# Altium project PCB_Project.PrjPcb
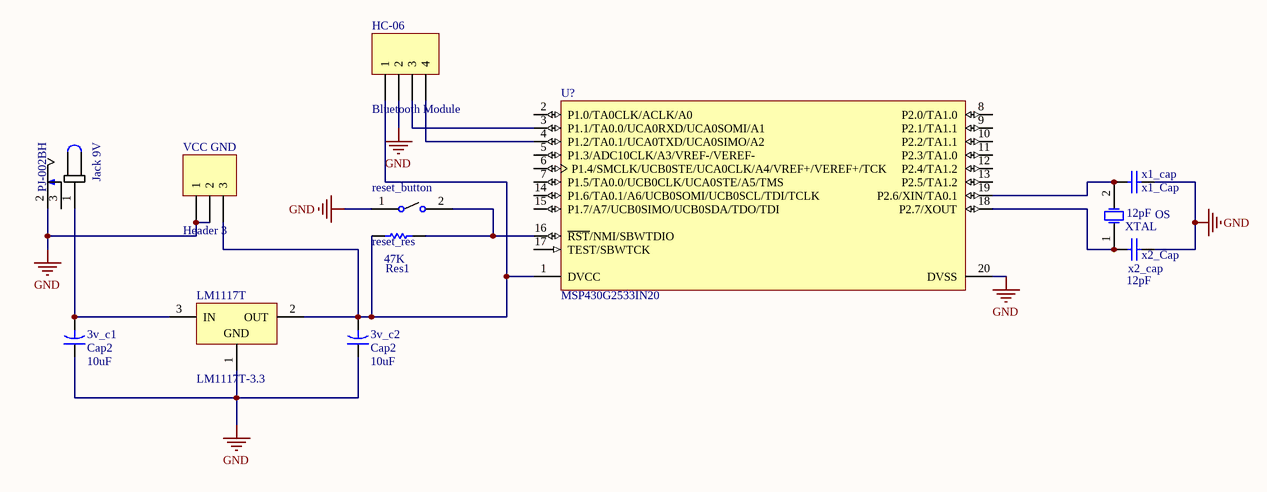
[diagram p0: Sheet1.SchDoc]
1 sheet, 12 parts. Net scope: global (net labels, ports and power ports of the same name join across sheets).
Board file: PCB1.PcbDoc

## Sheet Sheet1.SchDoc
size A4

### Parts
3v_c1  Cap2  value 10uF  [CAPR5-4X5]
3v_c2  Cap2  value 10uF  [CAPR5-4X5]
HC-06  Bluetooth Module  [HDR1X4]
Jack_9V  PJ-002BH  [CUI_PJ-002BH]
LM1117T  LM1117T-3.3  [T03B]
OS  XTAL  [R38]
reset_button  FSM8JRT _147694-1_  [TE_FSM8JRT]  (value not drawn)
reset_res  Res1  value 47K  [AXIAL-0.3]
U?  MSP430G2533IN20  [TI-N20]
VCC_GND  Header 3  [HDR1X3]
x1_cap  x1_Cap  value 12pF  [RAD-0.3]
x2_cap  x2_Cap  value 12pF  [RAD-0.3]

### Nets
GND: 3v_c1.1 3v_c2.1 HC-06.2 Jack_9V.2 LM1117T.1(GND) reset_button.1 U?.20(DVSS) VCC_GND.1 VCC_GND.2 x1_cap.2 x2_cap.2
Net3v_c1_2: 3v_c1.2 Jack_9V.1 LM1117T.3(IN)
Net3v_c2_2: 3v_c2.2 HC-06.1 LM1117T.2(OUT) reset_res.1 U?.1(DVCC) VCC_GND.3
NetHC-06_3: HC-06.3 U?.3(P1.1/TA0.0/UCA0RXD/UCA0SOMI/A1)
NetHC-06_4: HC-06.4 U?.4(P1.2/TA0.1/UCA0TXD/UCA0SIMO/A2)
NetOS_1: OS.1(OSC1) U?.18(P2.7/XOUT) x2_cap.1
NetOS_2: OS.2(OSC2) U?.19(P2.6/XIN/TA0.1) x1_cap.1
Netreset_button_2: reset_button.2 reset_res.2 U?.16(~{RST}/NMI/SBWTDIO)

Not connected (* = marked no-connect by the designer): Jack_9V 3; U? 2(P1.0/TA0CLK/ACLK/A0) 5(P1.3/ADC10CLK/A3/VREF-/VEREF-) 6(P1.4/SMCLK/UCB0STE/UCA0CLK/A4/VREF+/VEREF+/TCK) 7(P1.5/TA0.0/UCB0CLK/UCA0STE/A5/TMS) 8(P2.0/TA1.0) 9(P2.1/TA1.1) 10(P2.2/TA1.1) 11(P2.3/TA1.0) 12(P2.4/TA1.2) 13(P2.5/TA1.2) 14(P1.6/TA0.1/A6/UCB0SOMI/UCB0SCL/TDI/TCLK) 15(P1.7/A7/UCB0SIMO/UCB0SDA/TDO/TDI) 17(TEST/SBWTCK)

### Library data of the parts
3v_c1 3v_c2 = Cap2: Capacitor; Published: 23-Sep-2002; PackageReference: CAPR5-4X5; Publisher: Altium Limited; PackageDescription: Capacitor; 2 Leads
HC-06 = Header 4: Header, 4-Pin; LatestRevisionDate: 17-Jul-2002; LatestRevisionNote: Re-released for DXP Platform.; Publisher: Altium Limited
Jack_9V = PJ-002BH: 2.5 mm Center Pin, 5.0 A, Right Angle, Through Hole, Dc Power Jack Connector; MF: CUI; Package: None; MP: PJ-002BH; SnapEDA_Link: https://www.snapeda.com/parts/PJ-002BH/CUI%20Inc/view-part/?ref=snap; Availability: Good; Price: 0.42 USD; Value: *
LM1117T = LM1117T-3.3: 800mA Low-Dropout Linear Regulator, 3-pin TO-220; Manufacturer: National Semiconductor; PackageTopMarking: NSUZXYTTE#*LM1117T*3.3; PowerWise: N; CompType: LDO IC; High-Reliability: Y; DatasheetVersion: Apr-2006; PackageVersion: revL, Jan-1992; PackageReference: T03B; PackageDescription: TO-220, Molded, 3 Lead, Straight; PartNumber: LM1117T-3.3; RoHS: N; PinCount: 3; ComponentLink1Description: Manufacturer URL; ComponentLink1URL: http://www.national.com/; ComponentLink2Description: LM1117 Datasheet; ComponentLink2URL: http://www.national.com/ds/LM/LM1117.pdf; ComponentLink3Description: LM1117 Web Page; ComponentLink3URL: http://www.national.com/pf/LM/LM1117.html; ComponentLink4Description: T03B Package Page; ComponentLink4URL: http://www.national.com/packaging/folders/t03b.html
OS = XTAL: Crystal Oscillator; Published: 8-Jun-2000; LatestRevisionDate: 17-Jul-2002; LatestRevisionNote: Re-released for DXP Platform.; PackageReference: R38; Publisher: Altium Limited; PackageDescription: Crystal, Thru-Hole; 2 Leads; Body 3.1 x 8.2 mm (Dia.xH)
reset_button = FSM8JRT: FSM8JRT=SWITCH,PUSHBUTTON,TACT; MF: TE Connectivity; Configuration_Pole-Throw: Single Pole - Single Throw; Contact_Current_Rating: 50 mA; Price: 0.09 USD; Package: None; EU_RoHS_Compliance: Compliant; MP: FSM8JRT; SnapEDA_Link: https://www.snapeda.com/parts/FSM8JRT/TE%20Connectivity%20/%20DEUTSCH/view-part/?ref=snap; Availability: Good; Link: http://www.te.com/usa-en/product-147694-1.html; Value: *
reset_res = Res1: Resistor; Published: 8-Jun-2000; LatestRevisionDate: 17-Jul-2002; LatestRevisionNote: Re-released for DXP Platform.; PackageReference: AXIAL-0.3; Publisher: Altium Limited; PackageDescription: Axial Device, Thru-Hole; 2 Leads; 0.3 in Pin Spacing
U? = MSP430G2533IN20: 16 MHz Mixed Signal Microcontroller with 16 KB Flash, 512 B SRAM and 24 GPIOs, -40 to 85 degC, 20-pin DIP (N), Pb-Free (RoHS); Manufacturer: Texas Instruments; ADC: 10-bit SAR; ADC Channels: 8; Brown Out Reset: Yes; Flash(KB): 16; GPIO: 24; SRAM(B): 512; SubFamily: Value Line; Timers - 16-bit: 2; USCI_A (UART/LIN/IrDA/SPI): 1; DatasheetVersion: SLAS734D; PackageVersion: 4040049/E; PackageReference: N20; PackageDescription: 20-Pin Plastic In-Line, Body 25.40 x 6.35 mm, Pitch 2.54 mm; Supplier 1: Digi-Key; Supplier Part Number 1: MSP430G2513IRHB32T-ND; Supplier 2: Mouser; Supplier Part Number 2: 595-P430G2513IRHB32T; Cap touch I/O: Yes; Eco-Plan: Pb-Free (RoHS); Frequency(MHz): 16; Temp Sensor: Yes; USCI_B (I2C & SPI): 1; Watchdog: Yes; Mounting Technology: Through Hole; Code_JEDEC: MS-001; PartNumber: MSP430G2533IN20; ComponentLink1Description: Manufacturer URL; ComponentLink1URL: http://www.ti.com/; ComponentLink2Description: Datasheet; ComponentLink2URL: http://www.ti.com/general/docs/lit/getliterature.tsp?genericPartNumber=MSP430G2533&fileType=pdf; ComponentLink3Description: Package Specification; ComponentLink3URL: http://www.ti.com/litv/pdf/mpds177g
VCC_GND = Header 3: Header, 3-Pin; LatestRevisionDate: 17-Jul-2002; LatestRevisionNote: Re-released for DXP Platform.; Publisher: Altium Limited
x1_cap x2_cap = Cap: Capacitor; Published: 8-Jun-2000; LatestRevisionDate: 17-Jul-2002; LatestRevisionNote: Re-released for DXP Platform.; PackageReference: RAD-0.3; Publisher: Altium Limited; PackageDescription: Radial Cap, Thru-Hole; 2 Leads; 0.3 in Pin Spacing